# EAGLE schematic multiplication (EAGLE 9.2.2)
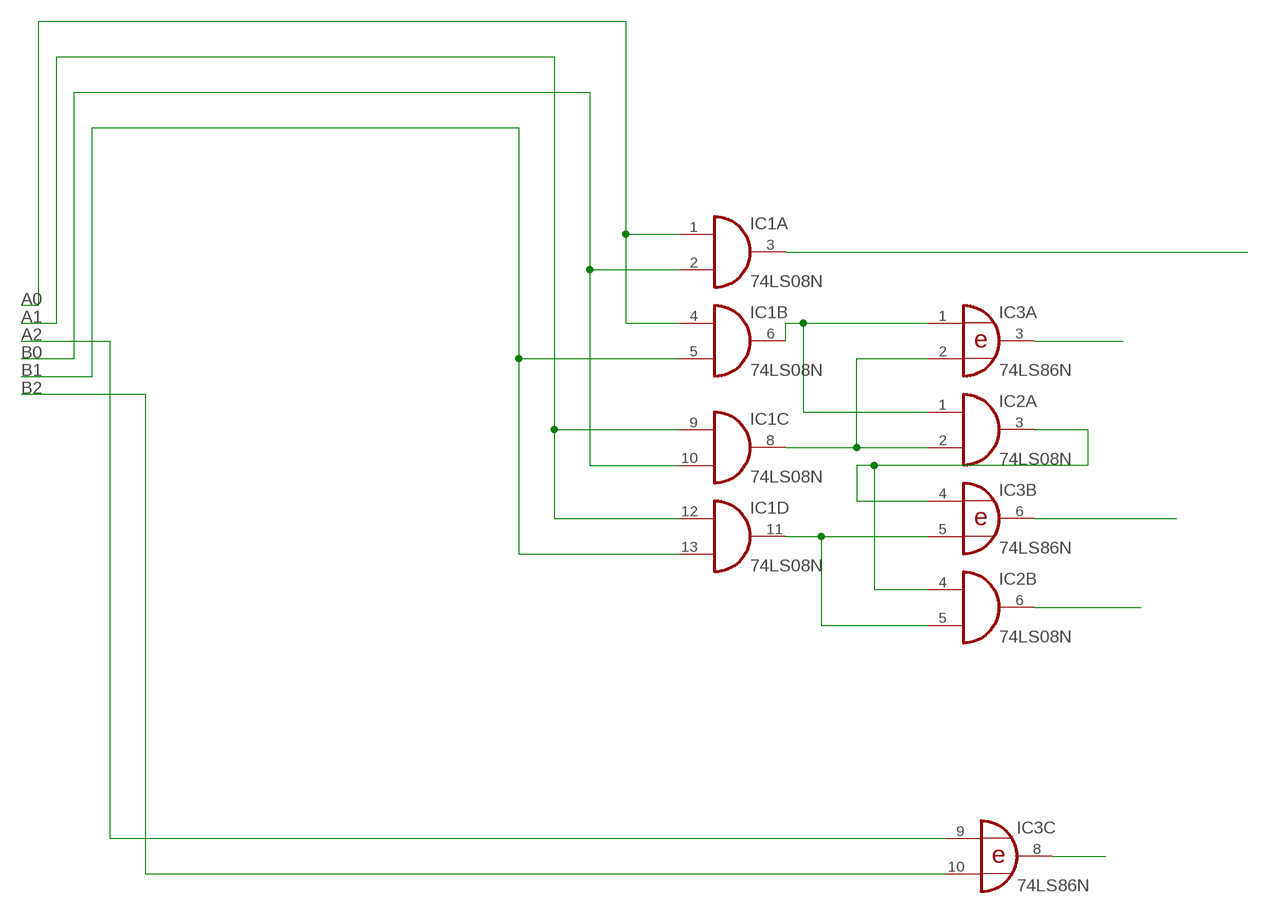
[diagram p0: schematic, sheet 1]

## Parts
IC1  74LS08N  [DIL14]
IC2  74LS08N  [DIL14]
IC3  74LS86N  [DIL14]

## Nets
A0: IC1.1(A:I0) IC1.4(B:I0)
A1: IC1.9(C:I0) IC1.12(D:I0)
A2: IC3.9(C:I0)
B0: IC1.2(A:I1) IC1.10(C:I1)
B1: IC1.5(B:I1) IC1.13(D:I1)
B2: IC3.10(C:I1)
N$1: IC1.3(A:O)
N$2: IC3.8(C:O)
N$3: IC2.6(B:O)
N$16: IC1.6(B:O) IC2.1(A:I0) IC3.1(A:I0)
N$17: IC1.8(C:O) IC2.2(A:I1) IC3.2(A:I1)
N$18: IC3.3(A:O)
N$19: IC2.3(A:O) IC2.4(B:I0) IC3.4(B:I0)
N$20: IC1.11(D:O) IC2.5(B:I1) IC3.5(B:I1)
N$22: IC3.6(B:O)
Unconnected: IC2.8(C:O) IC2.9(C:I0) IC2.10(C:I1) IC2.11(D:O) IC2.12(D:I0) IC2.13(D:I1) IC3.11(D:O) IC3.12(D:I0) IC3.13(D:I1)

## Power pins joined to a net without a drawn wire
GND: IC1.7(P:GND) IC2.7(P:GND) IC3.7(P:GND)
VCC: IC1.14(P:VCC) IC2.14(P:VCC) IC3.14(P:VCC)

## Library data of the parts
IC1 IC2 = 74xx-eu:74*08: Quad 2-input AND gate
IC3 = 74xx-eu:74*86: Quad 2-input EXCLUSIVE-OR (XOR) gate